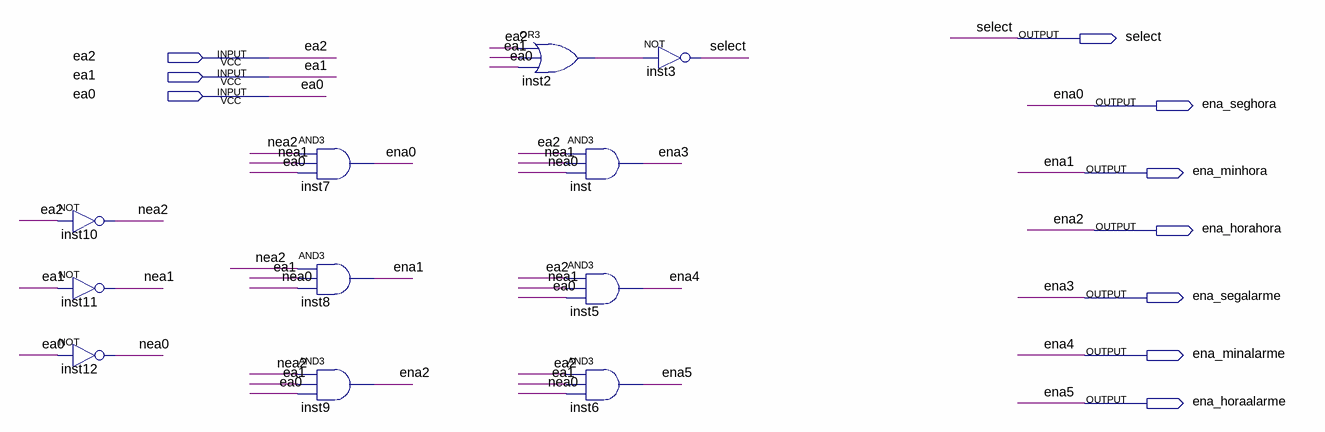
[diagram p0: schematic sheet]
// Quartus schematic enables.bdf as structural Verilog: 11 symbols, 10 pins
module enables (
  input  ea2,
  input  ea1,
  input  ea0,
  output select,
  output ena_seghora,
  output ena_minhora,
  output ena_horahora,
  output ena_segalarme,
  output ena_minalarme,
  output ena_horaalarme
);

  wire inst2_out, nea0, nea1, nea2;

  not inst10 (nea2, ea2);
  not inst11 (nea1, ea1);
  not inst12 (nea0, ea0);
  and inst7 (ena_seghora, nea2, nea1, ea0);
  and inst8 (ena_minhora, nea2, ea1, nea0);
  and inst9 (ena_horahora, nea2, ea1, ea0);
  or inst2 (inst2_out, ea2, ea1, ea0);
  and inst (ena_segalarme, ea2, nea1, nea0);
  and inst5 (ena_minalarme, ea2, nea1, ea0);
  and inst6 (ena_horaalarme, ea2, ea1, nea0);
  not inst3 (select, inst2_out);

  // Other names for the same wires on the sheet: ena0 = ena_seghora; ena1 = ena_minhora; ena2 = ena_horahora;
  //   ena3 = ena_segalarme; ena4 = ena_minalarme; ena5 = ena_horaalarme
endmodule
